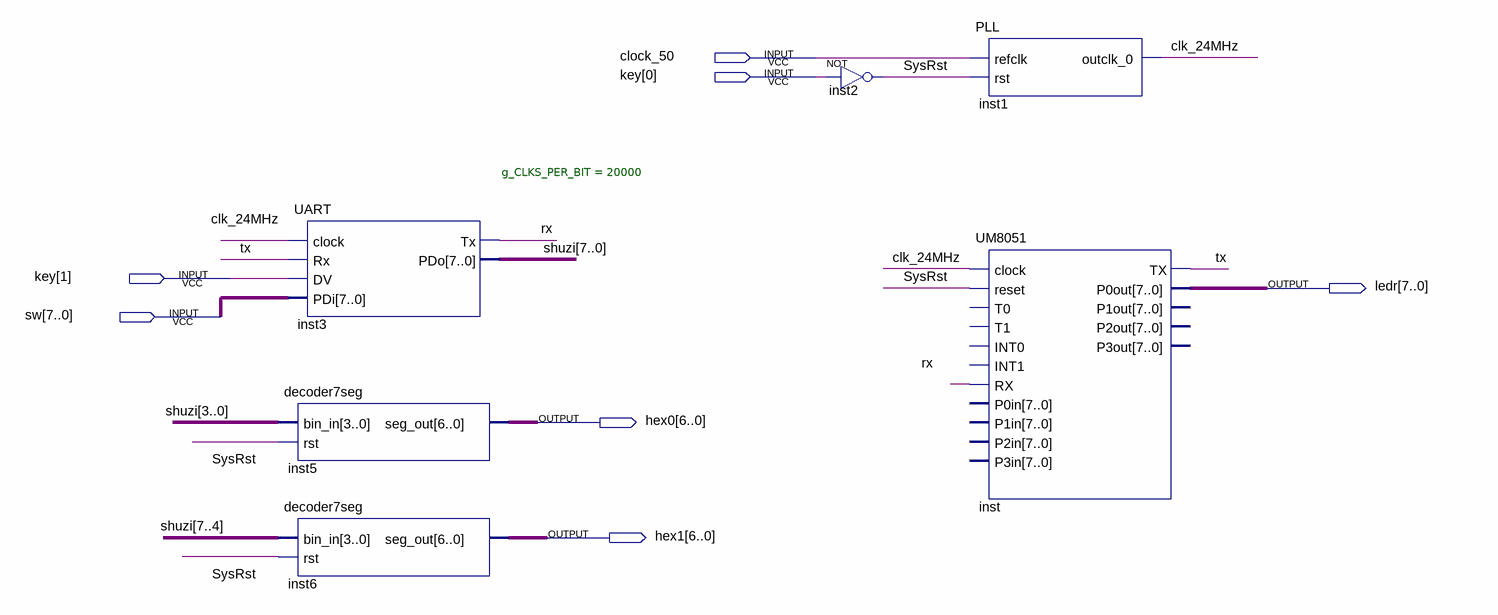
[diagram p0: schematic sheet]
// Quartus schematic lab2.bdf as structural Verilog: 6 symbols, 7 pins
module lab2 (
  input  clock_50,
  input  [1:0] key,
  input  [7:0] sw,
  output [7:0] ledr,
  output [6:0] hex0,
  output [6:0] hex1
);

  wire clk_24MHz, rx, SysRst, tx;
  wire [7:0] shuzi;

  UART #(.g_CLKS_PER_BIT(20000)) inst3 (.clock(clk_24MHz), .Rx(tx), .DV(key[1]), .PDi(sw), .Tx(rx), .PDo(shuzi));
  decoder7seg inst5 (.bin_in(shuzi[3:0]), .rst(SysRst), .seg_out(hex0));
  decoder7seg inst6 (.bin_in(shuzi[7:4]), .rst(SysRst), .seg_out(hex1));
  not inst2 (SysRst, key[0]);
  PLL inst1 (.refclk(clock_50), .rst(SysRst), .outclk_0(clk_24MHz));
  UM8051 inst (
    .clock(clk_24MHz), .reset(SysRst), .RX(rx), .TX(tx), .P0out(ledr));  // open: T0, T1, INT0, INT1, P0in, P1in, P2in, P3in, P1out, P2out, P3out
endmodule
